# EAGLE design sensor_board (EAGLE 6.1)
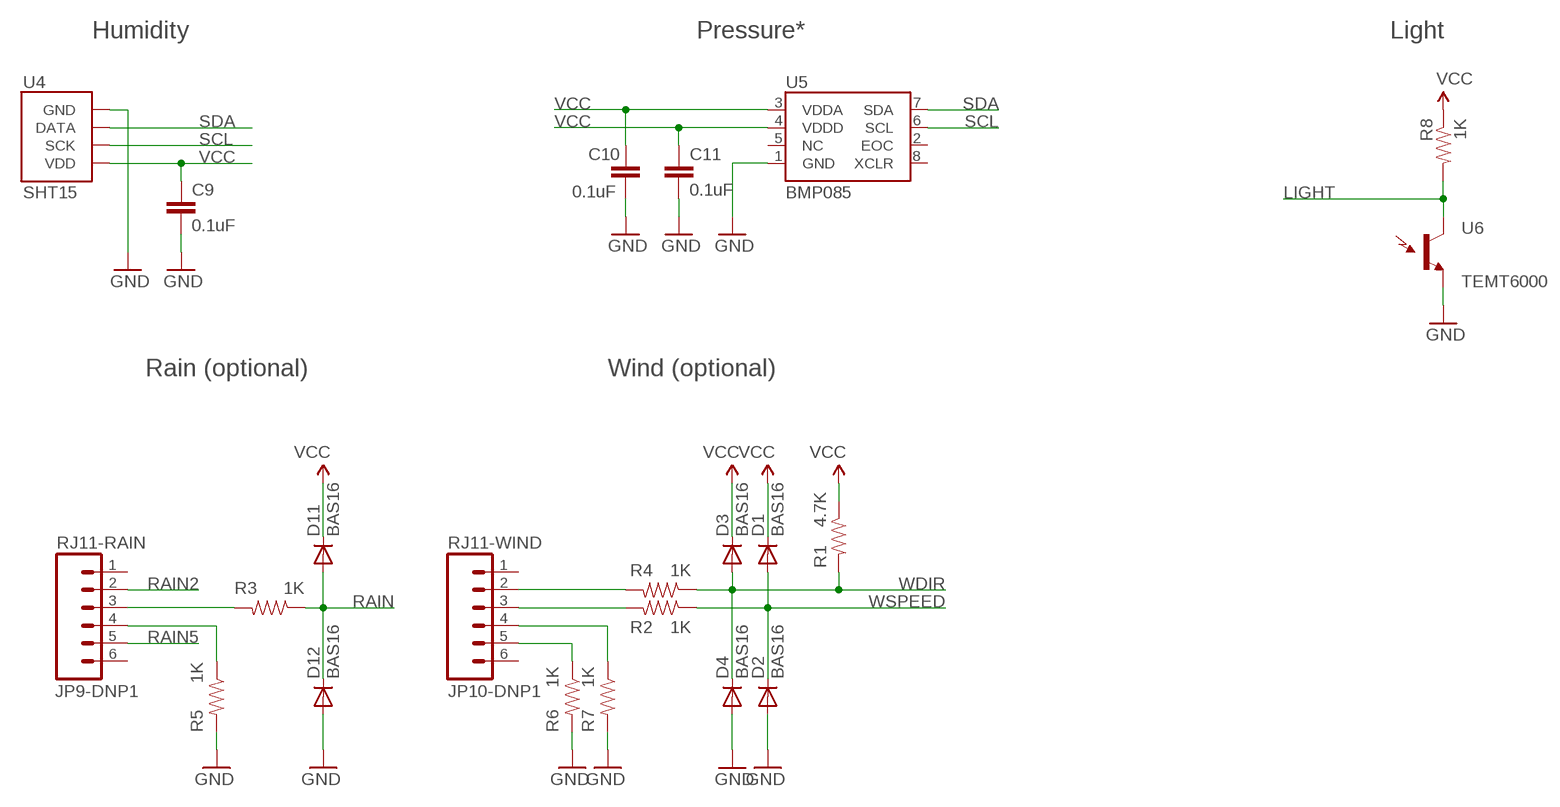
[diagram p0: schematic, sheet 1]

## Parts
C9  0.1uF  CAP0402-CAP  [0402-CAP]
C10  0.1uF  CAP0402-CAP  [0402-CAP]
C11  0.1uF  CAP0402-CAP  [0402-CAP]
D1  BAS16  DIODESOD  [SOD-323]
D2  BAS16  DIODESOD  [SOD-323]
D3  BAS16  DIODESOD  [SOD-323]
D4  BAS16  DIODESOD  [SOD-323]
D11  BAS16  DIODESOD  [SOD-323]
D12  BAS16  DIODESOD  [SOD-323]
JP9-DNP1  RJ11-RAIN  RJ11-6PTH  [RJ11-6]
JP10-DNP1  RJ11-WIND  RJ11-6PTH  [RJ11-6]
R1  4.7K  RESISTOR0402-RES  [0402-RES]
R2  1K  RESISTOR0402-RES  [0402-RES]
R3  1K  RESISTOR0402-RES  [0402-RES]
R4  1K  RESISTOR0402-RES  [0402-RES]
R5  1K  RESISTOR0402-RES  [0402-RES]
R6  1K  RESISTOR0402-RES  [0402-RES]
R7  1K  RESISTOR0402-RES  [0402-RES]
R8  1K  RESISTOR0402-RES  [0402-RES]
U4  SHT15  SHT1XSMD  [SHT1X]
U5  BMP085  [BMP085]
U6  TEMT6000  [TEMT6000-SEN]

## Nets
GND: C9.2 C10.1 C11.2 D2.2(A) D4.2(A) D12.2(A) R5.2 R6.2 R7.2 U4.1(GND) U5.1(GND) U6.EMITTER(E1)
LIGHT: R8.2 U6.COLLECTOR(C1)
N$1: JP10-DNP1.2 R4.2
N$4: JP10-DNP1.3 R2.2
N$5: JP9-DNP1.3 R3.2
N$6: JP9-DNP1.4 R5.1
N$8: JP10-DNP1.5 R6.1
N$9: JP10-DNP1.4 R7.1
RAIN: D11.2(A) D12.1(C) R3.1
RAIN2: JP9-DNP1.2
RAIN5: JP9-DNP1.5
SCL: U4.3(SCK) U5.6(SCL)
SDA: U4.2(DATA) U5.7(SDA)
VCC: C9.1 C10.2 C11.1 D1.1(C) D3.1(C) D11.1(C) R1.1 R8.1 U4.4(VDD) U5.3(VDDA) U5.4(VDDD)
WDIR: D3.2(A) D4.1(C) R1.2 R4.1
WSPEED: D1.2(A) D2.1(C) R2.1
Unconnected: JP9-DNP1.1 JP9-DNP1.6 JP10-DNP1.1 JP10-DNP1.6 U5.2(EOC) U5.5(NC) U5.8(XCLR)

## Notes on the sheet
- Humidity | Pressure* | Light
- Rain (optional) | Wind (optional)

## Library data of the parts
C9-C11 = SparkFun:CAP: Capacitor Standard 0603 ceramic capacitor, and 0.1" leaded capacitor.
D1-D4 D11 D12 = SparkFun:DIODE: Diode These are standard reverse protection diodes and small signal diodes. SMA package can handle up to about 1A. SOD-323 can handle about 200mA. What the SOD-323 package when ordering, there are some mfgs out there that are 5-pin packages.
JP9-DNP1 JP10-DNP1 = SparkFun:RJ11-6: RJ11 Jack Simple 6 pin RJ11 jack. Commonly found on CAT3 devices and Microchip programmers. SKU: PRT-00132
R1-R8 = SparkFun:RESISTOR: Resistor Basic schematic elements and footprints for 0603, 1206, and PTH resistors.
U4 = SparkFun:SHT1X: SHT1x Humdity Sensor Sensirion humdity sensor. Schematic element and footprint proven. Spark Fun Electronics SKU : COM-08227
U5 = SparkFun:BMP085: BMP085 Pressure Sensor Great little MEMS pressure sensor. SKU: COM-09603
U6 = SparkFun:TEMT6000: Ambient Light Sensor Simple light detection sensor. Output varies with light intensity input. Spark Fun Electronics SKU : COM-08348

## Net classes
0 Default: width 0.203 mm
1 Power: width 0.305 mm

## Board
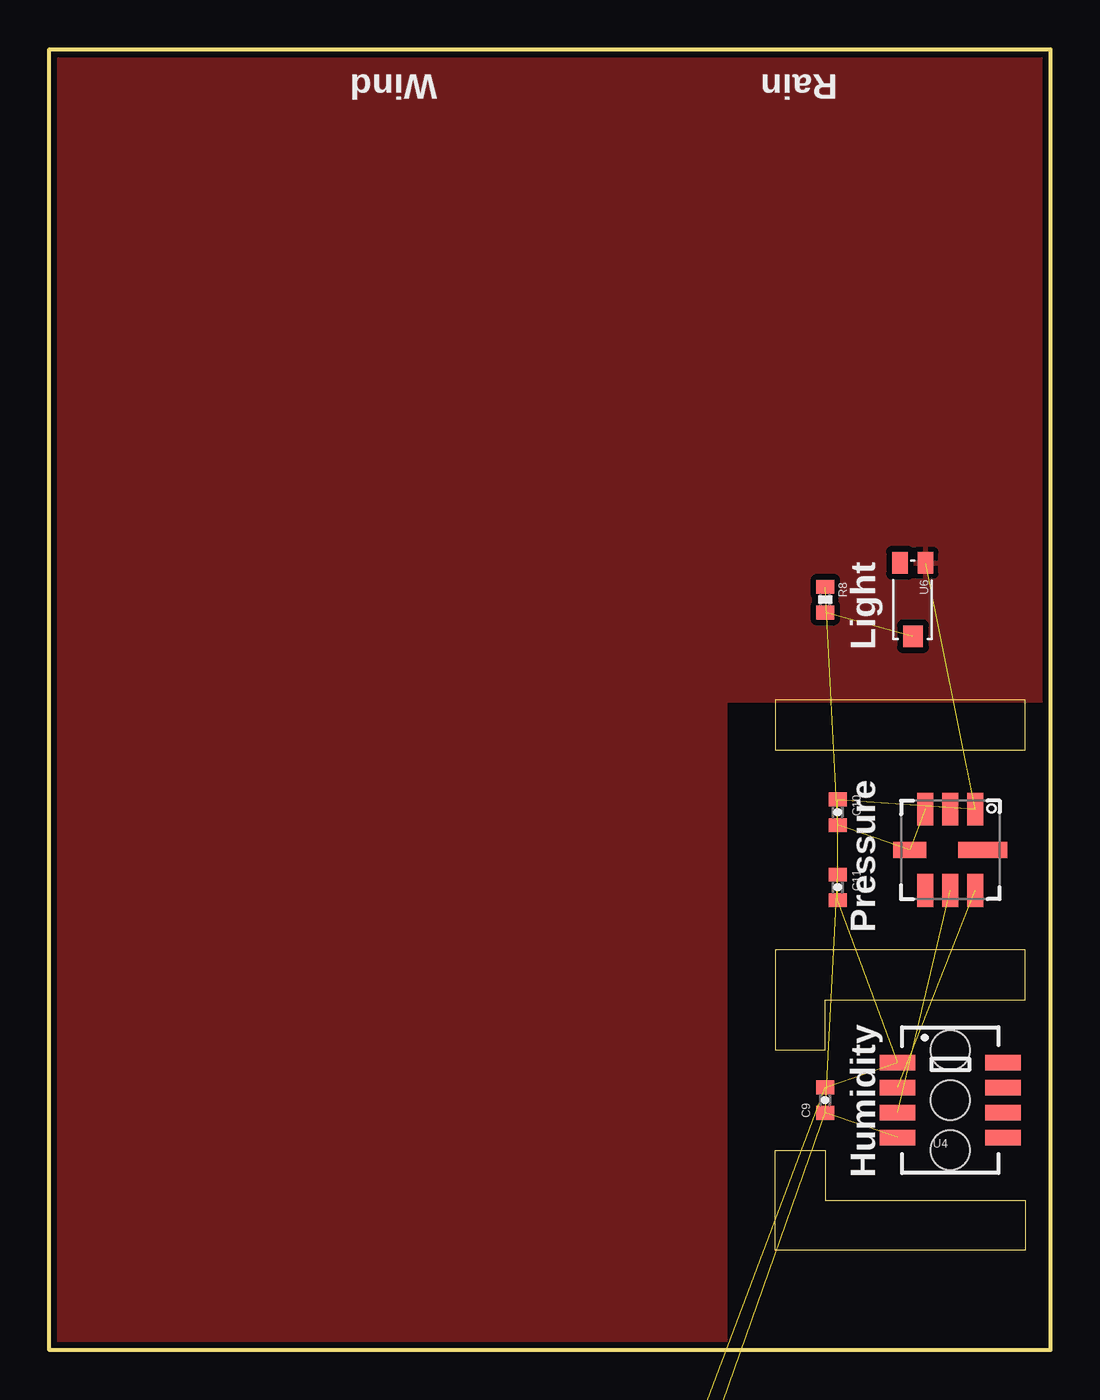
[diagram p1: board, top side]
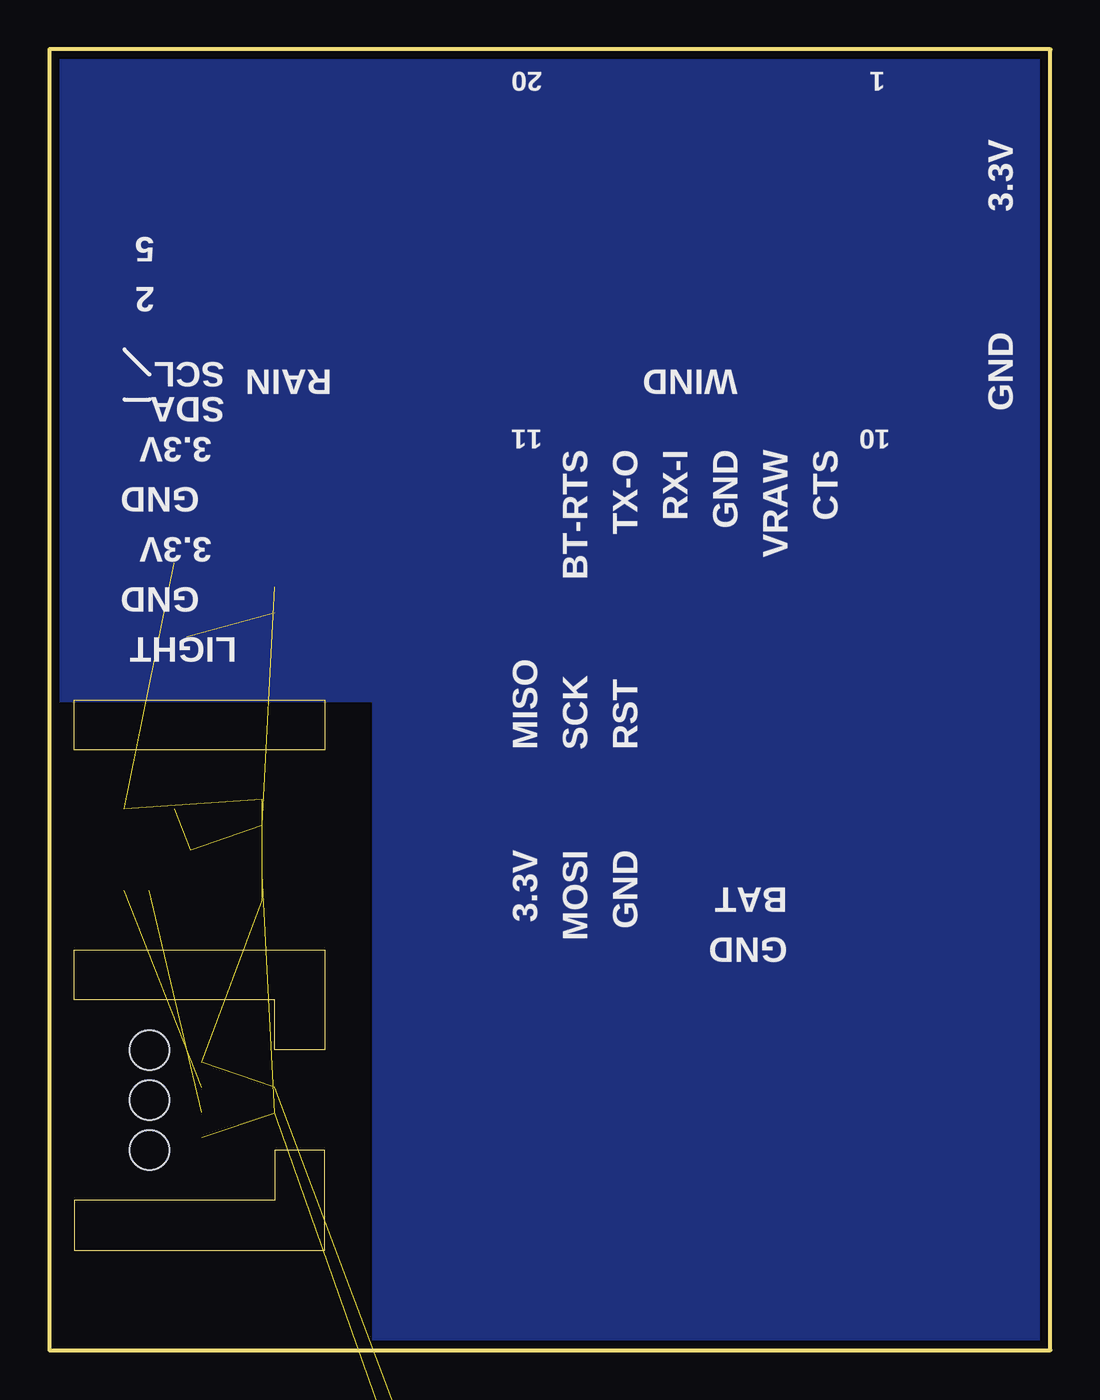
[diagram p2: board, bottom side, seen from below]

Size 50.8 x 66.04 mm. Coordinates in mm from the lower left corner, seen from the top.
Outline: 0,66.04 50.8,66.04 50.8,0 0,0 0,66.04
Copper layers (1*16): Top 0.035mm / dielectric 1.5mm / Bottom 0.035mm
Design rules: minimum track width 8mil, minimum drill 20mil, track to track 8mil, track to pad 8mil, pad to pad 8mil, via to via 8mil, smd to smd 8mil, copper to edge 8mil, drill to drill 8mil, minimum pad ring 12mil, minimum via ring 10mil, stop-mask expansion 4mil, vias tented up to drill 20mil, thermal gap 10mil
Holes 2 mm at 45.72,15.24 45.72,12.7 45.72,10.16
Milling: area 36.8,15.2 to 49.5,20.3; area 36.8,5.1 to 49.5,10.2; area 36.8,30.5 to 49.5,33

### Footprints (pad centres in the part's own frame; a part is rotated, then mirrored left to right if it is on the bottom)
0402-CAP = smd 0.7 x 0.9: 1 -0.65,0; 2 0.65,0
SOD-323 = smd 0.63 x 0.83: 1 -1.15,0; 2 1.15,0
RJ11-6 = drill 1.016 pad 1.88: 1 1.905,8.89; 2 3.175,6.35; 3 4.445,8.89; 4 5.715,6.35; 5 6.985,8.89; 6 8.255,6.35 | hole 3.251: 0,0; 10.16,0
0402-RES = smd 0.7 x 0.9: 1 -0.65,0; 2 0.65,0
SHT1X = smd 1.8 x 0.8: 1 -2.667,1.905; 2 -2.667,0.635; 3 -2.667,-0.635; 4 -2.667,-1.905; 5 2.667,-1.905; 6 2.667,-0.635; 7 2.667,0.635; 8 2.667,1.905
BMP085 = smd 1.67 x 0.8: 1 -2.065,1.27; 2 -2.065,0; 3 -2.065,-1.27; 5 2.065,-1.27; 6 2.065,0; 7 2.065,1.27 | smd 0.8 x 1.67: 4 0,-2.065 | smd 0.8 x 2.5: 8 0,1.65
TEMT6000-SEN = smd 1.1 x 0.8: BASE -1.87,-0.65; EMITTER -1.87,0.65 | smd 1.1 x 1: COLLECTOR 1.86,0.01

### Placement (x,y rotation side)
C9  39.37,12.7 90 top
C10  40.01,27.3 270 top
C11  40.01,23.5 270 top
D1  16.51,-34.29 0 top  (outside the outline)
D2  20.32,-34.29 0 top  (outside the outline)
D3  24.13,-34.29 0 top  (outside the outline)
D4  2.54,-53.34 0 top  (outside the outline)
D11  6.35,-53.34 0 top  (outside the outline)
D12  10.16,-53.34 0 top  (outside the outline)
JP9-DNP1  2.54,-24.13 0 top  (outside the outline)
JP10-DNP1  2.54,-43.18 0 top  (outside the outline)
R1  13.97,-53.34 0 top  (outside the outline)
R2  17.78,-53.34 0 top  (outside the outline)
R3  21.59,-53.34 0 top  (outside the outline)
R4  25.4,-53.34 0 top  (outside the outline)
R5  2.54,-57.15 0 top  (outside the outline)
R6  6.35,-57.15 0 top  (outside the outline)
R7  10.16,-57.15 0 top  (outside the outline)
R8  39.37,38.1 270 top
U4  45.72,12.7 0 top
U5  45.72,25.4 270 top
U6  43.81,38.1 270 top

### Tracks (layer width: path | path; a pad name or v marks a point on that pad's centre or on a via)
GND  (11 unrouted)
  pour Bottom (isolate 0.406): 34.29,0 34.29,33.02 50.8,33.02 50.8,66.04 0,66.04 0,0
  pour Top (isolate 0.305): 34.29,0 34.29,33.02 50.8,33.02 50.8,66.04 0,66.04 0,0
LIGHT  (1 unrouted)
N$1  (1 unrouted)
N$4  (1 unrouted)
N$5  (1 unrouted)
N$6  (1 unrouted)
N$8  (1 unrouted)
N$9  (1 unrouted)
RAIN  (2 unrouted)
SCL  (1 unrouted)
SDA  (1 unrouted)
VCC  (10 unrouted)
WDIR  (3 unrouted)
WSPEED  (2 unrouted)

### Text on the board
tPlace: Wind | Rain | Light | Pressure | Humidity
bPlace: 1 | 20 | 3.3V | 5 | 2 | GND | WIND | RAIN | SCL | SDA | 10 | 11 | CTS | VRAW | GND | RX-I | TX-O | BT-RTS | 3.3V | GND | 3.3V | GND | LIGHT | RST | SCK | MISO | GND | MOSI | 3.3V | BAT | GND
tValues: DNP | DNP | DNP | SMD Button | USB Weather Board v3 | R. Owens, M. Grusin